# EAGLE design redox-light-right (EAGLE 9.1.3)
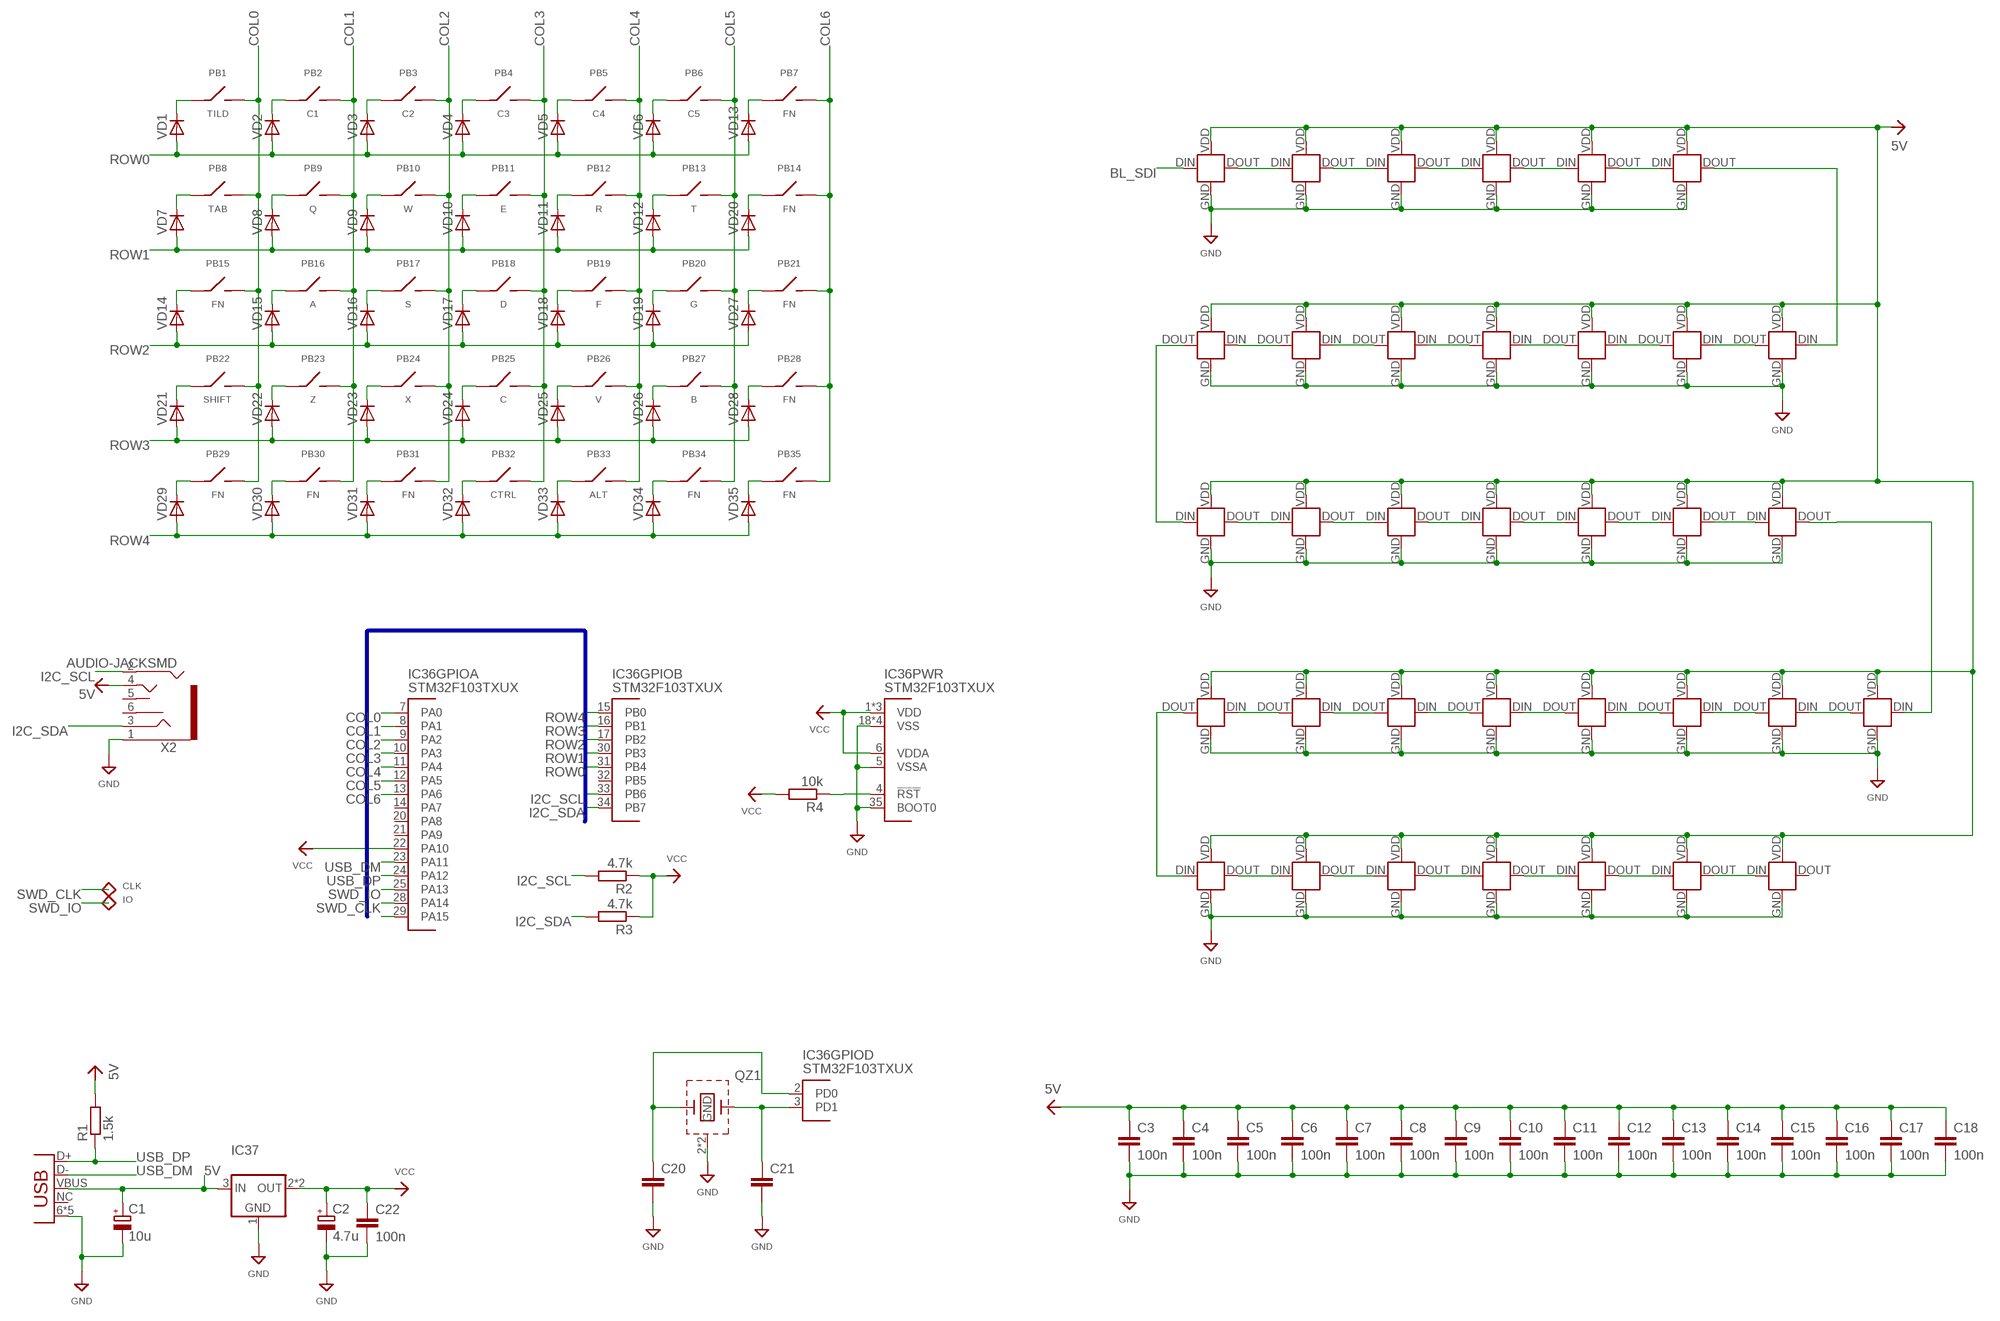
[diagram p0: schematic, sheet 1]

## Parts
C1  10u  CPOL-EUSMCA  [SMC_A]
C2  4.7u  CPOL-EUSMCA  [SMC_A]
C3  100n  CAP0402  [R0402]
C4  100n  CAP0402  [R0402]
C5  100n  CAP0402  [R0402]
C6  100n  CAP0402  [R0402]
C7  100n  CAP0402  [R0402]
C8  100n  CAP0402  [R0402]
C9  100n  CAP0402  [R0402]
C10  100n  CAP0402  [R0402]
C11  100n  CAP0402  [R0402]
C12  100n  CAP0402  [R0402]
C13  100n  CAP0402  [R0402]
C14  100n  CAP0402  [R0402]
C15  100n  CAP0402  [R0402]
C16  100n  CAP0402  [R0402]
C17  100n  CAP0402  [R0402]
C18  100n  CAP0402  [R0402]
C20  CAP0402  [R0402]
C21  CAP0402  [R0402]
C22  100n  CAP0402  [R0402]
IC1  SK68XX-MINI  [SK68XX-MINI]
IC2  SK68XX-MINI  [SK68XX-MINI]
IC3  SK68XX-MINI  [SK68XX-MINI]
IC4  SK68XX-MINI  [SK68XX-MINI]
IC5  SK68XX-MINI  [SK68XX-MINI]
IC6  SK68XX-MINI  [SK68XX-MINI]
IC7  SK68XX-MINI  [SK68XX-MINI]
IC8  SK68XX-MINI  [SK68XX-MINI]
IC9  SK68XX-MINI  [SK68XX-MINI]
IC10  SK68XX-MINI  [SK68XX-MINI]
IC11  SK68XX-MINI  [SK68XX-MINI]
IC12  SK68XX-MINI  [SK68XX-MINI]
IC13  SK68XX-MINI  [SK68XX-MINI]
IC14  SK68XX-MINI  [SK68XX-MINI]
IC15  SK68XX-MINI  [SK68XX-MINI]
IC16  SK68XX-MINI  [SK68XX-MINI]
IC17  SK68XX-MINI  [SK68XX-MINI]
IC18  SK68XX-MINI  [SK68XX-MINI]
IC19  SK68XX-MINI  [SK68XX-MINI]
IC20  SK68XX-MINI  [SK68XX-MINI]
IC21  SK68XX-MINI  [SK68XX-MINI]
IC22  SK68XX-MINI  [SK68XX-MINI]
IC23  SK68XX-MINI  [SK68XX-MINI]
IC24  SK68XX-MINI  [SK68XX-MINI]
IC25  SK68XX-MINI  [SK68XX-MINI]
IC26  SK68XX-MINI  [SK68XX-MINI]
IC27  SK68XX-MINI  [SK68XX-MINI]
IC28  SK68XX-MINI  [SK68XX-MINI]
IC29  SK68XX-MINI  [SK68XX-MINI]
IC30  SK68XX-MINI  [SK68XX-MINI]
IC31  SK68XX-MINI  [SK68XX-MINI]
IC32  SK68XX-MINI  [SK68XX-MINI]
IC33  SK68XX-MINI  [SK68XX-MINI]
IC34  SK68XX-MINI  [SK68XX-MINI]
IC35  SK68XX-MINI  [SK68XX-MINI]
IC36  STM32F103TXUX  [QFN-36]
IC37  LM1117  [SOT89]
PB1  TILD  CHERRY-MX-KAILH  [CHERRY-MX-KAILH]
PB2  C1  CHERRY-MX-KAILH  [CHERRY-MX-KAILH]
PB3  C2  CHERRY-MX-KAILH  [CHERRY-MX-KAILH]
PB4  C3  CHERRY-MX-KAILH  [CHERRY-MX-KAILH]
PB5  C4  CHERRY-MX-KAILH  [CHERRY-MX-KAILH]
PB6  C5  CHERRY-MX-KAILH  [CHERRY-MX-KAILH]
PB7  FN  CHERRY-MX-KAILH  [CHERRY-MX-KAILH]
PB8  TAB  CHERRY-MX-KAILH  [CHERRY-MX-KAILH]
PB9  Q  CHERRY-MX-KAILH  [CHERRY-MX-KAILH]
PB10  W  CHERRY-MX-KAILH  [CHERRY-MX-KAILH]
PB11  E  CHERRY-MX-KAILH  [CHERRY-MX-KAILH]
PB12  R  CHERRY-MX-KAILH  [CHERRY-MX-KAILH]
PB13  T  CHERRY-MX-KAILH  [CHERRY-MX-KAILH]
PB14  FN  CHERRY-MX-KAILH  [CHERRY-MX-KAILH]
PB15  FN  CHERRY-MX-KAILH  [CHERRY-MX-KAILH]
PB16  A  CHERRY-MX-KAILH  [CHERRY-MX-KAILH]
PB17  S  CHERRY-MX-KAILH  [CHERRY-MX-KAILH]
PB18  D  CHERRY-MX-KAILH  [CHERRY-MX-KAILH]
PB19  F  CHERRY-MX-KAILH  [CHERRY-MX-KAILH]
PB20  G  CHERRY-MX-KAILH  [CHERRY-MX-KAILH]
PB21  FN  CHERRY-MX-KAILH  [CHERRY-MX-KAILH]
PB22  SHIFT  CHERRY-MX-KAILH  [CHERRY-MX-KAILH]
PB23  Z  CHERRY-MX-KAILH  [CHERRY-MX-KAILH]
PB24  X  CHERRY-MX-KAILH  [CHERRY-MX-KAILH]
PB25  C  CHERRY-MX-KAILH  [CHERRY-MX-KAILH]
PB26  V  CHERRY-MX-KAILH  [CHERRY-MX-KAILH]
PB27  B  CHERRY-MX-KAILH  [CHERRY-MX-KAILH]
PB28  FN  CHERRY-MX-KAILH  [CHERRY-MX-KAILH]
PB29  FN  CHERRY-MX-KAILH  [CHERRY-MX-KAILH]
PB30  FN  CHERRY-MX-KAILH  [CHERRY-MX-KAILH]
PB31  FN  CHERRY-MX-KAILH  [CHERRY-MX-KAILH]
PB32  CTRL  CHERRY-MX-KAILH  [CHERRY-MX-KAILH]
PB33  ALT  CHERRY-MX-KAILH  [CHERRY-MX-KAILH]
PB34  FN  CHERRY-MX-KAILH  [CHERRY-MX-KAILH]
PB35  FN  CHERRY-MX-KAILH  [CHERRY-MX-KAILH]
QZ1  QUARTZ_GND3225  [3225]
R1  1.5k  RESR0402  [R0402]
R2  4.7k  RESR0402  [R0402]
R3  4.7k  RESR0402  [R0402]
R4  10k  RESR0402  [R0402]
TP1  CLK  TP10R  [TP10R]
TP2  IO  TP10R  [TP10R]
VD1  DIODE-SOD123  [SOD123]
VD2  DIODE-SOD123  [SOD123]
VD3  DIODE-SOD123  [SOD123]
VD4  DIODE-SOD123  [SOD123]
VD5  DIODE-SOD123  [SOD123]
VD6  DIODE-SOD123  [SOD123]
VD7  DIODE-SOD123  [SOD123]
VD8  DIODE-SOD123  [SOD123]
VD9  DIODE-SOD123  [SOD123]
VD10  DIODE-SOD123  [SOD123]
VD11  DIODE-SOD123  [SOD123]
VD12  DIODE-SOD123  [SOD123]
VD13  DIODE-SOD123  [SOD123]
VD14  DIODE-SOD123  [SOD123]
VD15  DIODE-SOD123  [SOD123]
VD16  DIODE-SOD123  [SOD123]
VD17  DIODE-SOD123  [SOD123]
VD18  DIODE-SOD123  [SOD123]
VD19  DIODE-SOD123  [SOD123]
VD20  DIODE-SOD123  [SOD123]
VD21  DIODE-SOD123  [SOD123]
VD22  DIODE-SOD123  [SOD123]
VD23  DIODE-SOD123  [SOD123]
VD24  DIODE-SOD123  [SOD123]
VD25  DIODE-SOD123  [SOD123]
VD26  DIODE-SOD123  [SOD123]
VD27  DIODE-SOD123  [SOD123]
VD28  DIODE-SOD123  [SOD123]
VD29  DIODE-SOD123  [SOD123]
VD30  DIODE-SOD123  [SOD123]
VD31  DIODE-SOD123  [SOD123]
VD32  DIODE-SOD123  [SOD123]
VD33  DIODE-SOD123  [SOD123]
VD34  DIODE-SOD123  [SOD123]
VD35  DIODE-SOD123  [SOD123]
X1  USBMICRO_B  [USB_MICROB]
X2  AUDIO-JACKSMD  [PJ-342]

## Nets
5V: C1.+ C3.1 C4.1 C5.1 C6.1 C7.1 C8.1 C9.1 C10.1 C11.1 C12.1 C13.1 C14.1 C15.1 C16.1 C17.1 C18.1 IC1.VDD(VCC) IC2.VDD(VCC) IC3.VDD(VCC) IC4.VDD(VCC) IC5.VDD(VCC) IC6.VDD(VCC) IC7.VDD(VCC) IC8.VDD(VCC) IC9.VDD(VCC) IC10.VDD(VCC) IC11.VDD(VCC) IC12.VDD(VCC) IC13.VDD(VCC) IC14.VDD(VCC) IC15.VDD(VCC) IC16.VDD(VCC) IC17.VDD(VCC) IC18.VDD(VCC) IC19.VDD(VCC) IC20.VDD(VCC) IC21.VDD(VCC) IC22.VDD(VCC) IC23.VDD(VCC) IC24.VDD(VCC) IC25.VDD(VCC) IC26.VDD(VCC) IC27.VDD(VCC) IC28.VDD(VCC) IC29.VDD(VCC) IC30.VDD(VCC) IC31.VDD(VCC) IC32.VDD(VCC) IC33.VDD(VCC) IC34.VDD(VCC) IC35.VDD(VCC) IC37.3(IN) R1.2 X1.VBUS X2.4
BL_SDI: IC1.DIN IC36.29(GPIOA:PA15)
COL0 [KEYS-MATRIX]: IC36.7(GPIOA:PA0) PB1.2 PB8.2 PB15.2 PB22.2 PB29.2
COL1 [KEYS-MATRIX]: IC36.8(GPIOA:PA1) PB2.2 PB9.2 PB16.2 PB23.2 PB30.2
COL2 [KEYS-MATRIX]: IC36.9(GPIOA:PA2) PB3.2 PB10.2 PB17.2 PB24.2 PB31.2
COL3 [KEYS-MATRIX]: IC36.10(GPIOA:PA3) PB4.2 PB11.2 PB18.2 PB25.2 PB32.2
COL4 [KEYS-MATRIX]: IC36.11(GPIOA:PA4) PB5.2 PB12.2 PB19.2 PB26.2 PB33.2
COL5 [KEYS-MATRIX]: IC36.12(GPIOA:PA5) PB6.2 PB13.2 PB20.2 PB27.2 PB34.2
COL6 [KEYS-MATRIX]: IC36.13(GPIOA:PA6) PB7.2 PB14.2 PB21.2 PB28.2 PB35.2
GND: C1.- C2.- C3.2 C4.2 C5.2 C6.2 C7.2 C8.2 C9.2 C10.2 C11.2 C12.2 C13.2 C14.2 C15.2 C16.2 C17.2 C18.2 C20.2 C21.2 C22.2 IC1.GND IC2.GND IC3.GND IC4.GND IC5.GND IC6.GND IC7.GND IC8.GND IC9.GND IC10.GND IC11.GND IC12.GND IC13.GND IC14.GND IC15.GND IC16.GND IC17.GND IC18.GND IC19.GND IC20.GND IC21.GND IC22.GND IC23.GND IC24.GND IC25.GND IC26.GND IC27.GND IC28.GND IC29.GND IC30.GND IC31.GND IC32.GND IC33.GND IC34.GND IC35.GND IC36.5(PWR:VSSA) IC36.18(PWR:VSS) IC36.26(PWR:VSS) IC36.35(PWR:BOOT0) IC36.36(PWR:VSS) IC36.PGND(PWR:VSS) IC37.1(GND) QZ1.2(GND) QZ1.4(GND) X1.6(GND) X1.7(GND) X1.8(GND) X1.9(GND) X1.GND X2.1
I2C_SCL: IC36.33(GPIOB:PB6) R2.2 X2.2
I2C_SDA: IC36.34(GPIOB:PB7) R3.2 X2.3
N$1: IC1.DOUT IC2.DIN
N$2: IC2.DOUT IC3.DIN
N$3: IC3.DOUT IC4.DIN
N$4: IC4.DOUT IC5.DIN
N$5: IC5.DOUT IC6.DIN
N$6: IC7.DOUT IC8.DIN
N$7: PB1.1 VD1.C
N$8: IC21.DOUT IC22.DIN
N$9: IC22.DOUT IC23.DIN
N$10: IC23.DOUT IC24.DIN
N$11: IC24.DOUT IC25.DIN
N$12: IC25.DOUT IC26.DIN
N$13: IC8.DOUT IC9.DIN
N$14: IC13.DOUT IC14.DIN
N$15: IC26.DOUT IC27.DIN
N$16: IC20.DOUT IC21.DIN
N$17: PB4.1 VD4.C
N$18: PB3.1 VD3.C
N$19: PB5.1 VD5.C
N$20: PB6.1 VD6.C
N$21: PB2.1 VD2.C
N$22: PB7.1 VD13.C
N$23: C20.1 IC36.2(GPIOD:PD0) QZ1.3
N$24: PB8.1 VD7.C
N$25: PB9.1 VD8.C
N$26: PB10.1 VD9.C
N$27: PB11.1 VD10.C
N$28: PB12.1 VD11.C
N$29: PB13.1 VD12.C
N$30: PB14.1 VD20.C
N$31: C21.1 IC36.3(GPIOD:PD1) QZ1.1
N$32: IC9.DOUT IC10.DIN
N$33: IC10.DOUT IC11.DIN
N$34: IC11.DOUT IC12.DIN
N$35: IC36.4(PWR:!RST) R4.1
N$36: IC12.DOUT IC13.DIN
N$37: IC6.DOUT IC7.DIN
N$38: IC14.DOUT IC15.DIN
N$39: IC15.DOUT IC16.DIN
N$40: IC16.DOUT IC17.DIN
N$41: IC17.DOUT IC18.DIN
N$42: IC18.DOUT IC19.DIN
N$44: IC19.DOUT IC20.DIN
N$46: PB15.1 VD14.C
N$47: PB16.1 VD15.C
N$48: PB17.1 VD16.C
N$49: PB18.1 VD17.C
N$50: PB19.1 VD18.C
N$51: PB20.1 VD19.C
N$52: IC27.DOUT IC28.DIN
N$53: IC29.DOUT IC30.DIN
N$54: PB22.1 VD21.C
N$55: PB23.1 VD22.C
N$56: PB29.1 VD29.C
N$57: PB30.1 VD30.C
N$58: PB24.1 VD23.C
N$59: PB25.1 VD24.C
N$60: PB26.1 VD25.C
N$61: PB27.1 VD26.C
N$62: PB21.1 VD27.C
N$63: PB28.1 VD28.C
N$64: PB31.1 VD31.C
N$65: PB32.1 VD32.C
N$66: PB33.1 VD33.C
N$67: PB34.1 VD34.C
N$68: PB35.1 VD35.C
N$69: IC30.DOUT IC31.DIN
N$70: IC31.DOUT IC32.DIN
N$71: IC32.DOUT IC33.DIN
N$72: IC33.DOUT IC34.DIN
N$74: IC34.DOUT IC35.DIN
N$75: IC28.DOUT IC29.DIN
ROW0 [KEYS-MATRIX]: IC36.31(GPIOB:PB4) VD1.A VD2.A VD3.A VD4.A VD5.A VD6.A VD13.A
ROW1 [KEYS-MATRIX]: IC36.30(GPIOB:PB3) VD7.A VD8.A VD9.A VD10.A VD11.A VD12.A VD20.A
ROW2 [KEYS-MATRIX]: IC36.17(GPIOB:PB2) VD14.A VD15.A VD16.A VD17.A VD18.A VD19.A VD27.A
ROW3 [KEYS-MATRIX]: IC36.16(GPIOB:PB1) VD21.A VD22.A VD23.A VD24.A VD25.A VD26.A VD28.A
ROW4 [KEYS-MATRIX]: IC36.15(GPIOB:PB0) VD29.A VD30.A VD31.A VD32.A VD33.A VD34.A VD35.A
SWD_CLK: IC36.28(GPIOA:PA14) TP1.TP(TEST)
SWD_IO: IC36.25(GPIOA:PA13) TP2.TP(TEST)
USB_DM: IC36.23(GPIOA:PA11) X1.D-
USB_DP: IC36.24(GPIOA:PA12) R1.1 X1.D+
VCC: C2.+ C22.1 IC36.1(PWR:VDD) IC36.6(PWR:VDDA) IC36.19(PWR:VDD) IC36.22(GPIOA:PA10) IC36.27(PWR:VDD) IC37.2(OUT) IC37.4(OUT) R2.1 R3.1 R4.2
Unconnected: IC35.DOUT IC36.14(GPIOA:PA7) IC36.20(GPIOA:PA8) IC36.21(GPIOA:PA9) IC36.32(GPIOB:PB5) X1.NC X2.5 X2.6

## Buses
BL_SDI,COL[0..7],FLASH_CS,I2C_SCL,I2C_SDA,ROW[0..4],SPI_MISO,SPI_MOSI,SPI_SCL,SR_CLK,SR_CLR,SR_D,SWD_CLK,SWD_IO,UART_RX,UART_TX,USB_DM,USB_DP

## Library data of the parts
C1 C2 = netcat:CPOL-EU
C3-C18 C20-C22 = netcat:CAP
IC1-IC6 IC14-IC35 = keyb:SK68XX
IC7-IC13 = keyb:SK68XX; SPICEPREFIX: E
IC36 = netcat:STM32F103
IC37 = netcat:LM1117
PB1-PB35 = keyb:CHERRY-MX
QZ1 = netcat:QUARTZ_GND
R1-R4 = netcat:RES
TP1 TP2 = netcat:TP
VD1-VD35 = netcat:DIODE
X1 = netcat:USB: USB Connectors USB-B-PTH is fully proven SKU : PRT-00139 USB-miniB is fully proven SKU : PRT-00587 USB-A-PCB is untested. USB-A-H is throughly reviewed, but untested. Spark Fun Electronics SKU : PRT-00437 USB-B-SMT is throughly reviewed, but untested. Needs silkscreen touching up. USB-A-S has not been used/tested USB-MB-H has not been used/tested
X2 = netcat:AUDIO-JACK

## Board
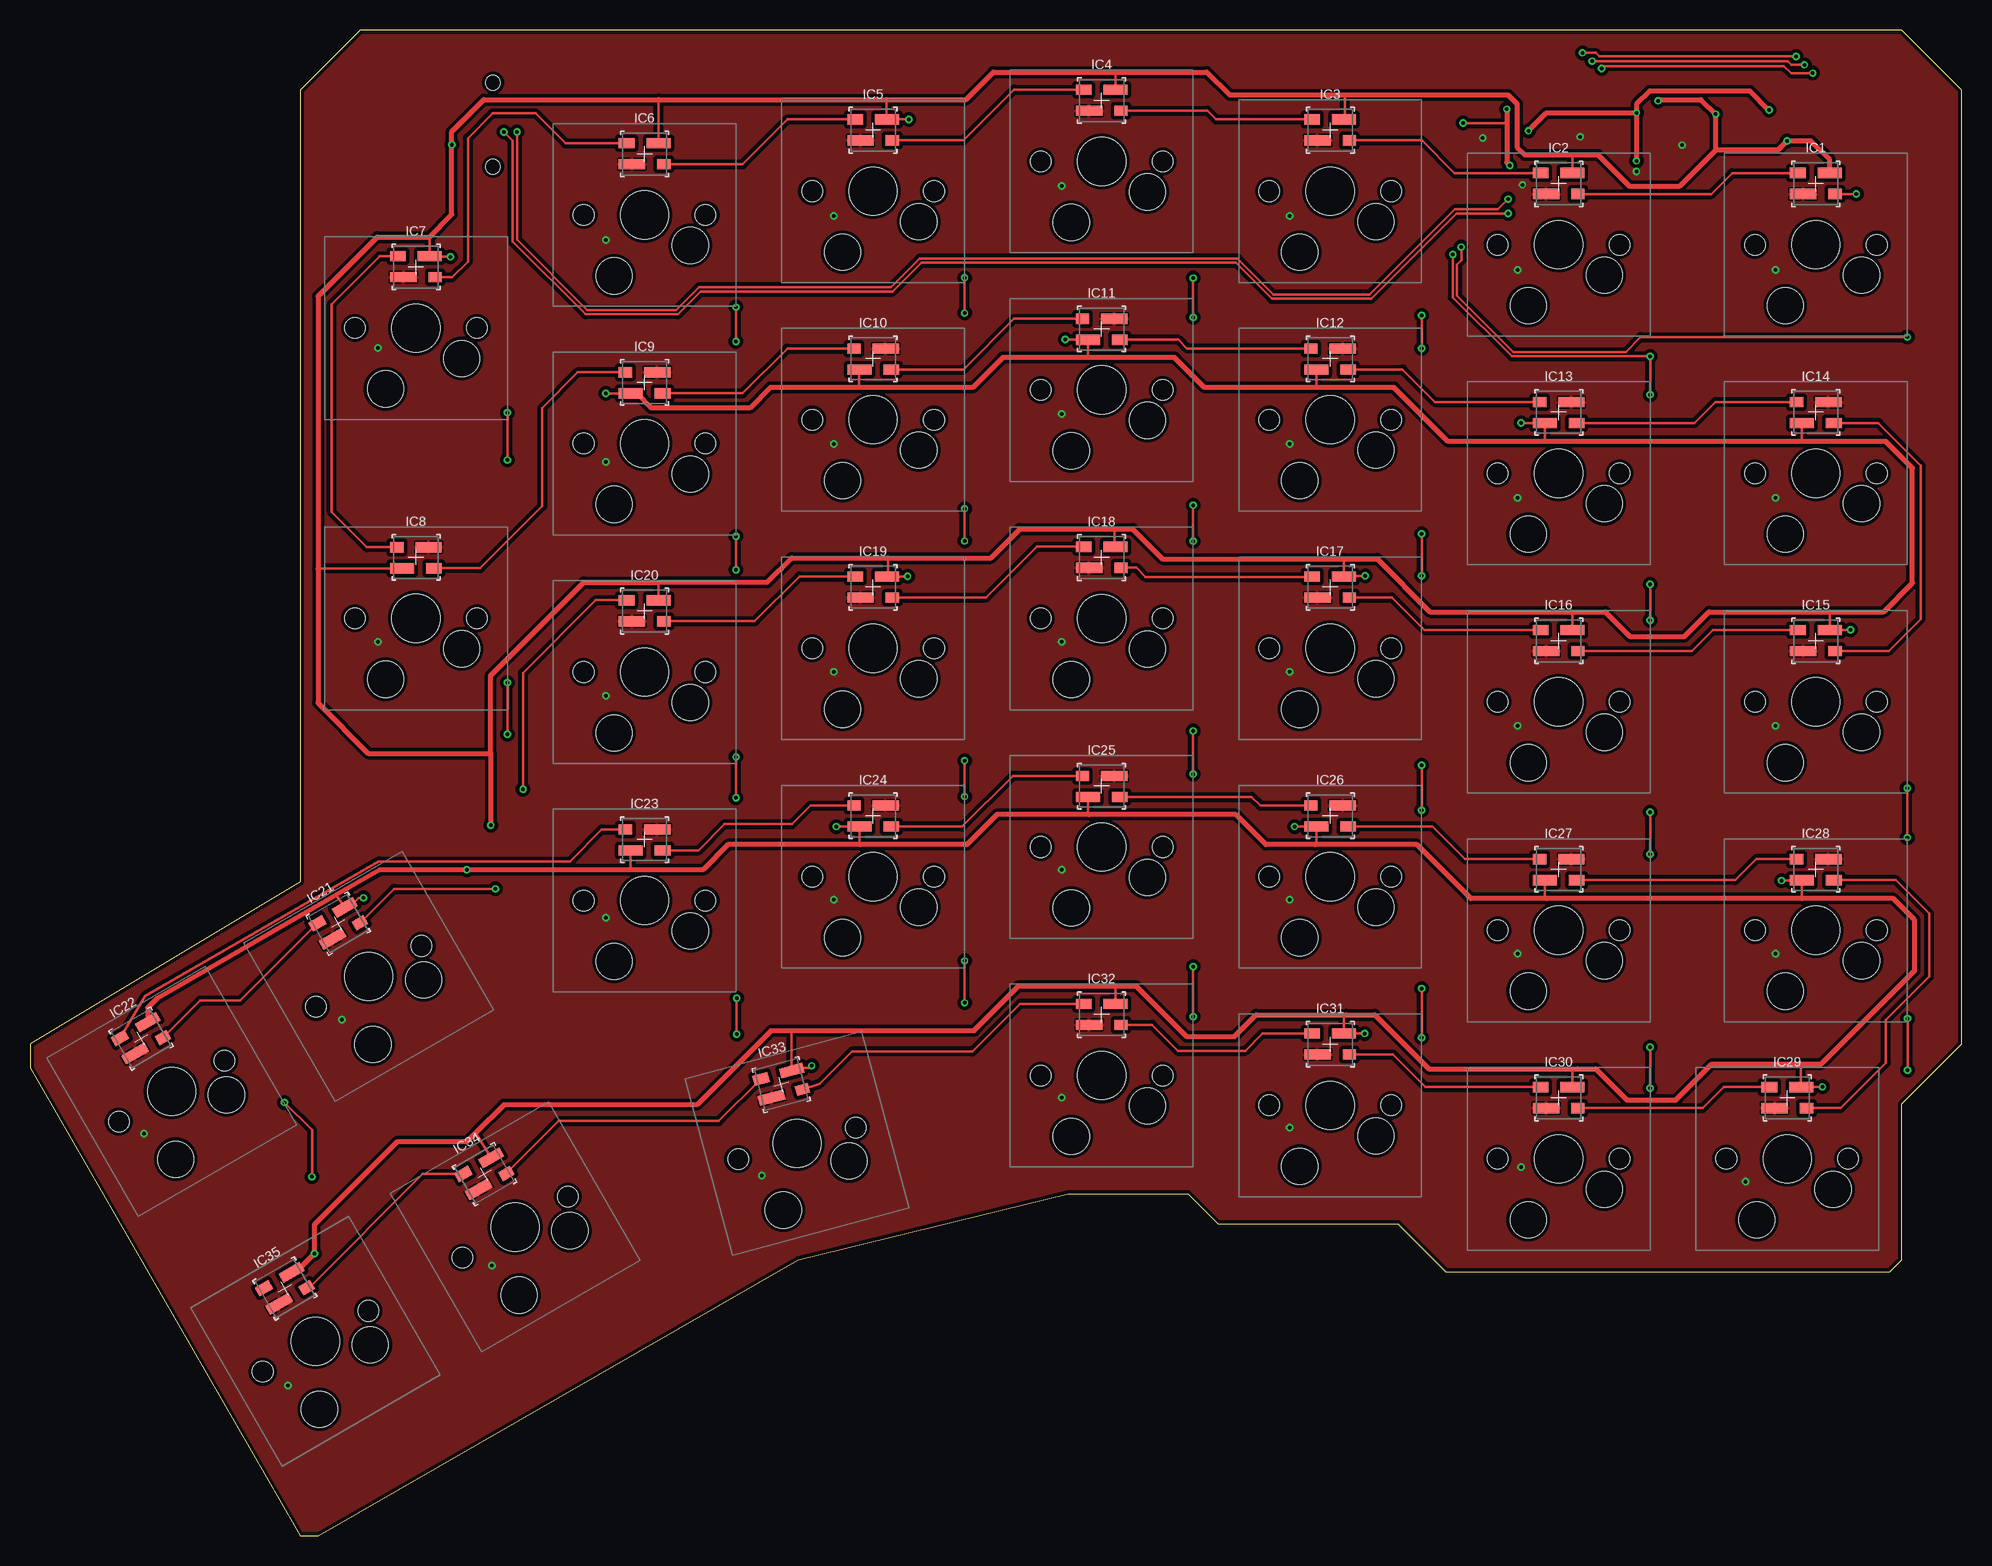
[diagram p1: board, top side]
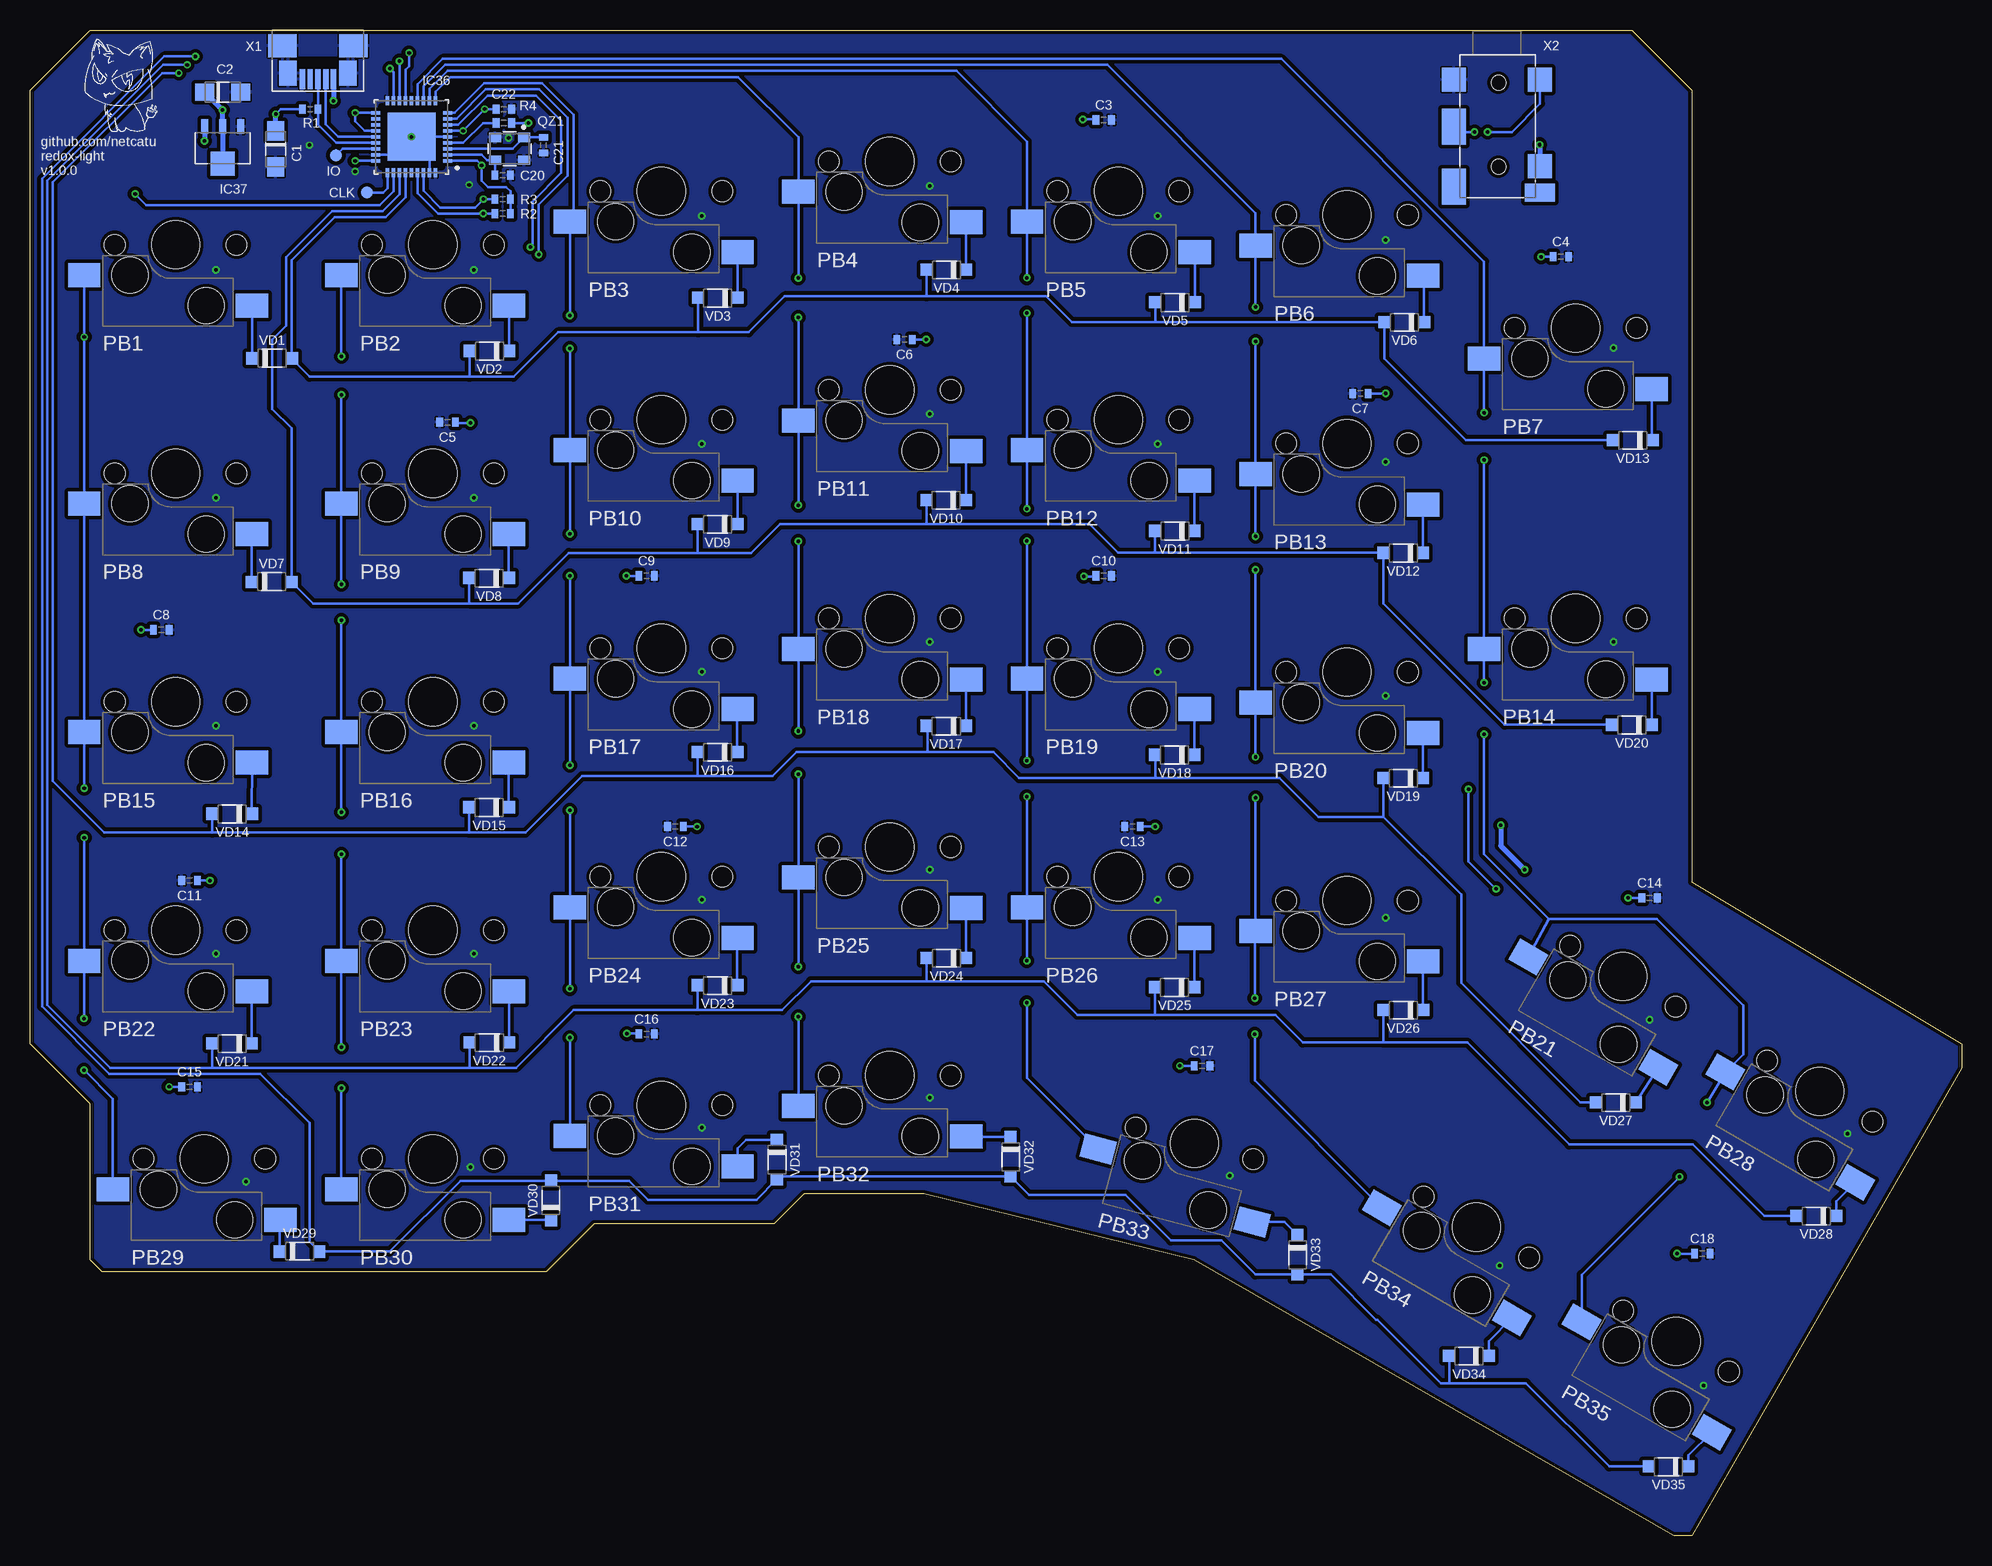
[diagram p2: board, bottom side, seen from below]

Size 161 x 125.5 mm. Coordinates in mm from the lower left corner, seen from the top.
Outline: 161,120.5 156,125.5 27.5,125.5 22.5,120.5 22.5,54.5 0,41 0,39 22.5,0 24,0 64,23 86.5,28.5 96.5,28.5 99,26 114,26 118,22 155,22 156,23 156,36 161,41 161,120.5
Copper layers (1+16): Top 0.035mm / dielectric 0.2mm / Bottom 0.035mm
Design rules "mini-spartan6-plus *": minimum track width 6mil, minimum drill 6mil, track to track 6mil, track to pad 6mil, pad to pad 6mil, via to via 6mil, smd to smd 0mil, copper to edge 6mil, drill to drill 6mil, minimum pad ring 10mil, minimum via ring 6mil, stop-mask expansion 2mil, vias tented up to drill 100mil, thermal gap 6mil
bRestrict: area 127.1,114.1 to 127.4,114.5; area 126.7,114.1 to 127.1,116.3; area 128,114.1 to 131.3,114.5; area 131.3,114.1 to 131.7,114.8; area 131.3,115.3 to 131.7,119.1; area 126.7,118.7 to 131.3,119.1; area 126.7,116.8 to 127.1,118.7

### Footprints (pad centres in the part's own frame; a part is rotated, then mirrored left to right if it is on the bottom)
SMC_A = smd 1.6 x 1.4: + -1.5,0; - 1.5,0
R0402 = smd 0.559 x 0.762: 1 -0.65,0; 2 0.65,0
SK68XX-MINI = smd 1.1 x 0.85: DIN 1.6,-0.85 | smd 1.3 x 0.85: DOUT -1.5,0.9 | smd 2.2 x 0.85: GND -1.05,-0.85 | smd 2 x 0.85: VDD 1.15,0.9
QFN-36 = smd 0.75 x 0.3: 1 -3,2; 2 -3,1.5; 3 -3,1; 4 -3,0.5; 5 -3,0; 6 -3,-0.5; 7 -3,-1; 8 -3,-1.5; 9 -3,-2; 19 3,-2; 20 3,-1.5; 21 3,-1; 22 3,-0.5; 23 3,0; 24 3,0.5; 25 3,1; 26 3,1.5; 27 3,2 | smd 0.3 x 0.75: 10 -2,-3; 11 -1.5,-3; 12 -1,-3; 13 -0.5,-3; 14 0,-3; 15 0.5,-3; 16 1,-3; 17 1.5,-3; 18 2,-3; 28 2,3; 29 1.5,3; 30 1,3; 31 0.5,3; 32 0,3; 33 -0.5,3; 34 -1,3; 35 -1.5,3; 36 -2,3 | smd 4 x 4: PGND 0,0
SOT89 = smd 0.58 x 1.2: 1 -1.5,-1.8; 2 0,-1.8; 3 1.5,-1.8 | smd 2 x 2: 4 0,1.3
CHERRY-MX-KAILH = smd 2.7 x 2 bottom: 1 -6.355,-5.08; 2 7.625,-2.54 | hole 4: 0,0 | hole 1.7: -5.08,0; 5.08,0 | hole 3: 3.81,-2.54; -2.54,-5.08
3225 = smd 1.016 x 0.762: 1 -1.28,-0.948; 2 1.121,-0.948; 3 1.121,0.948; 4 -1.28,0.948
TP10R = smd 1 x 1: TP 0,0
SOD123 = smd 1.016 x 1.016: A 1.646,-0.025; C -1.646,-0.025
USB_MICROB = smd 2.1 x 1.475: 6 2.3,-2.5; 8 2.3,2.5 | smd 1.9 x 2.375: 7 0,-2.95; 9 0,2.95 | smd 1.7 x 0.45: D+ 2.8,0; D- 2.8,0.65; GND 2.8,-1.3; NC 2.8,-0.65; VBUS 2.8,1.3
PJ-342 = smd 2 x 2: 1 -3.44,-3.73; 2 -3.44,3.47; 4 3.76,3.47 | smd 3 x 2: 3 0.46,-3.73; 6 5.46,-3.73 | smd 1.5 x 2.5: 5 5.96,3.47 | hole 1.2: 3.8,0; -3.2,0

### Placement (x,y rotation side)
C1  140.51,115.58 270 bottom
C2  144.95,120.33 0 bottom
C3  71.5,118 0 bottom
C4  33.4,106.6 0 bottom
C5  126.2,92.8 180 bottom
C6  88.1,99.7 180 bottom
C7  50.1,95.2 180 bottom
C8  150.05,75.5 0 bottom
C9  109.6,80 0 bottom
C10  71.5,80 0 bottom
C11  147.7,54.6 180 bottom
C12  107.2,59.1 180 bottom
C13  69.1,59.1 180 bottom
C14  26,53.15 0 bottom
C15  147.7,37.4 0 bottom
C16  109.6,41.8 0 bottom
C17  63.3,39.15 0 bottom
C18  21.6,23.5 0 bottom
C20  121.6,113.4 0 bottom
C21  118.2,115.9 270 bottom
C22  121.5,118.9 0 bottom
IC1  148.86,112.68 0 top
IC2  127.42,112.68 0 top
IC3  108.38,117.14 0 top
IC4  89.33,119.62 0 top
IC5  70.28,117.14 0 top
IC6  51.22,115.16 0 top
IC7  32.17,105.74 0 top
IC8  32.17,81.53 180 top
IC9  51.22,96.11 180 top
IC10  70.28,98.09 180 top
IC11  89.33,100.57 180 top
IC12  108.38,98.09 180 top
IC13  127.42,93.63 180 top
IC14  148.86,93.63 180 top
IC15  148.86,74.58 0 top
IC16  127.42,74.58 0 top
IC17  108.38,79.04 0 top
IC18  89.33,81.52 0 top
IC19  70.28,79.04 0 top
IC20  51.22,77.06 0 top
IC21  25.7,51.01 30 top
IC22  9.26,41.43 30 top
IC23  51.22,58.01 180 top
IC24  70.28,59.99 180 top
IC25  89.33,62.47 180 top
IC26  108.38,59.99 180 top
IC27  127.42,55.53 180 top
IC28  148.86,55.53 180 top
IC29  146.47,36.48 0 top
IC30  127.42,36.48 0 top
IC31  108.38,40.94 0 top
IC32  89.33,43.42 0 top
IC33  62.62,37.59 15 top
IC34  37.89,30.12 30 top
IC35  21.25,20.59 30 top
IC36  129.2,116.6 180 bottom
IC37  144.95,115.65 180 bottom
PB1  148.86,107.6 0 top
PB2  127.42,107.6 0 top
PB3  108.38,112.06 0 top
PB4  89.33,114.54 0 top
PB5  70.28,112.06 0 top
PB6  51.22,110.08 0 top
PB7  32.17,100.66 0 top
PB8  148.86,88.55 0 top
PB9  127.42,88.55 0 top
PB10  108.38,93.01 0 top
PB11  89.33,95.49 0 top
PB12  70.28,93.01 0 top
PB13  51.22,91.03 0 top
PB14  32.17,76.45 0 top
PB15  148.86,69.5 0 top
PB16  127.42,69.5 0 top
PB17  108.38,73.96 0 top
PB18  89.33,76.44 0 top
PB19  70.28,73.96 0 top
PB20  51.22,71.98 0 top
PB21  28.24,46.61 30 top
PB22  148.86,50.45 0 top
PB23  127.42,50.45 0 top
PB24  108.38,54.91 0 top
PB25  89.33,57.39 0 top
PB26  70.28,54.91 0 top
PB27  51.22,52.93 0 top
PB28  11.8,37.03 30 top
PB29  146.47,31.4 0 top
PB30  127.42,31.4 0 top
PB31  108.38,35.86 0 top
PB32  89.33,38.34 0 top
PB33  63.93,32.69 15 top
PB34  40.43,25.72 30 top
PB35  23.79,16.19 30 top
QZ1  121.1,115.6 180 bottom
R1  137.65,118.9 180 bottom
R2  121.6,110.2 180 bottom
R3  121.6,111.4 180 bottom
R4  121.5,117.75 0 bottom
TP1  132.9,111.95 0 bottom
TP2  135.5,115.05 0 bottom
U$1  [LOGO2]  153.4,120.9 0 bottom
VD1  140.82,98.14 0 bottom
VD2  122.7,98.73 180 bottom
VD3  103.67,103.15 180 bottom
VD4  84.62,105.5 180 bottom
VD5  65.56,102.78 180 bottom
VD6  46.44,101.13 180 bottom
VD7  140.85,79.52 0 bottom
VD8  122.74,79.8 180 bottom
VD9  103.69,84.28 180 bottom
VD10  84.64,86.28 180 bottom
VD11  65.57,83.73 180 bottom
VD12  46.53,81.9 180 bottom
VD13  27.4,91.3 180 bottom
VD14  144.15,60.14 180 bottom
VD15  122.73,60.68 180 bottom
VD16  103.69,65.28 180 bottom
VD17  84.63,67.47 180 bottom
VD18  65.59,65.07 180 bottom
VD19  46.53,63.12 180 bottom
VD20  27.49,67.56 180 bottom
VD21  144.16,41 180 bottom
VD22  122.71,41.08 180 bottom
VD23  103.69,45.84 180 bottom
VD24  84.62,48.13 180 bottom
VD25  65.59,45.69 180 bottom
VD26  46.52,43.79 180 bottom
VD27  28.8,36.09 180 bottom
VD28  12.1,26.63 180 bottom
VD29  138.53,23.7 0 bottom
VD30  117.58,27.93 90 bottom
VD31  98.73,31.33 270 bottom
VD32  79.24,31.58 270 bottom
VD33  55.33,23.41 270 bottom
VD34  41.05,14.95 180 bottom
VD35  24.42,5.74 180 bottom
X1  137,124.2 270 bottom
X2  38.6,117.9 270 bottom

### Tracks (layer width: path | path; a pad name or v marks a point on that pad's centre or on a via)
5V  (via drill 0.3)
  Top 0.203: IC33.VDD 63.5,38.8 | 63.5,38.8 63.5,42 63.6,42.1 | IC32.VDD 90.47,45.77 90.5,45.8 | IC31.VDD | IC31.VDD 109.53,43.23 109.7,43.4 | IC30.VDD 128.57,38.9 129,38.9 | 147.6,39.3 147.6,37.41 IC29.VDD 149.38,37.38 v149.4,37.4 | 147.7,53.1 147.71,53.11 IC28.VDD 147.68,54.6 v146,54.6 | IC27.VDD 126.28,53.1 126.4,53.1 | IC25.VDD 88.17,60.23 88.3,60.1 | IC23.VDD 50.08,55.5 50.1,55.5 | 25.53,53.4 IC21.VDD 26.61,52.36 27.4,53.15 v27.8,53.15 | IC20.VDD 52.4,77.96 52.4,79.45 | IC18.VDD 90.4,82.42 90.4,83.9 | IC16.VDD 128.57,77 128.5,77 | IC14.VDD 147.71,91.2 147.7,91.2 | IC12.VDD 107.22,95.7 107.4,95.7 | 88.3,98.2 88.17,98.2 IC11.VDD 86.33,99.67 v86.3,99.7 | IC10.VDD 69.1,97.19 69.1,95.7 | IC34.VDD 37.15,33.55 | IC6.VDD 52.38,119.67 52.4,119.7 | IC8.VDD 30.99,80.6 24,80.6 | 33.3,108.25 33.3,106.66 IC7.VDD 33.36,106.6 v35.05,106.6 | IC3.VDD 109.6,118.12 109.6,120.1 | v65.15,39.15 65,39 63.7,39 63.5,38.8 | v111.25,41.85 IC31.VDD | v105.4,59.1 v105.41,59.09 IC26.VDD 107.22,57.7 107.2,57.7 107.1,57.6 | v67.2,59.1 v67.21,59.09 IC24.VDD 69.12,57.6 69.2,57.6 | v73.15,79.95 v73.14,79.94 IC19.VDD 71.5,79.94 71.5,81.5 | v111.3,80 109.58,80 IC17.VDD 109.5,79.94 109.5,81.4 | v151.75,75.5 151.73,75.48 IC15.VDD 150,77 | v124.3,92.75 124.32,92.73 IC13.VDD 126.28,91.2 126.2,91.2 | IC9.VDD v48,95.2 | v73.25,118.05 v73.24,118.04 IC5.VDD 71.4,118.04 71.4,119.7 | IC2.VDD 128.57,115.1 128.6,115.1 | IC4.VDD 90.47,122 90.4,122
  Top 0.406: IC35.VDD 22.15,21.95 v23.7,23.5 23.7,25.9 30.6,32.8 36.4,32.8 37.15,33.55 39.5,35.9 55.6,35.9 61.8,42.1 63.6,42.1 78.7,42.1 82.4,45.8 90.5,45.8 92.2,45.8 96.4,41.6 100.4,41.6 102.2,43.4 109.7,43.4 112.1,43.4 116.6,38.9 129,38.9 130.5,38.9 133.1,36.3 137.2,36.3 140.2,39.3 147.6,39.3 149.3,39.3 157.1,47.1 157.1,51.3 155.3,53.1 147.7,53.1 126.4,53.1 120.1,53.1 115.6,57.6 107.1,57.6 103,57.6 100.5,60.1 88.3,60.1 80.6,60.1 78.1,57.6 69.2,57.6 58.2,57.6 56.1,55.5 50.1,55.5 v36.4,55.5 29.16,55.5 25.53,53.4 10.59,44.79 9.8,44 IC22.VDD | IC9.VDD 50.59,95.21 51.8,94 60,94 61.7,95.7 69.1,95.7 78.6,95.7 81.1,98.2 88.3,98.2 95.4,98.2 97.9,95.7 107.4,95.7 113.7,95.7 118.2,91.2 126.2,91.2 147.7,91.2 154.7,91.2 156.9,89 156.9,79.4 154.5,77 150,77 139.95,77 137.9,74.95 133.35,74.95 131.3,77 128.5,77 116.7,77 112.3,81.4 109.5,81.4 94.4,81.4 91.9,83.9 90.4,83.9 82.5,83.9 80.1,81.5 71.5,81.5 63.5,81.5 61.45,79.45 52.4,79.45 46.15,79.45 38.4,71.7 38.4,65.2 | 38.4,65.2 v38.4,59.2 | 140.5,118.48 v140.51,118.48 | IC1.VDD 150.01,114.69 148.45,116.25 v146.45,116.25 145.7,115.5 140.5,115.5 | 140.5,115.5 137.5,112.5 133.3,112.5 130.7,115.1 128.6,115.1 128.4,115.1 124.6,115.1 123.95,115.75 123.95,119.35 123.2,120.1 109.6,120.1 100,120.1 98.1,122 90.4,122 80.3,122 78,119.7 71.4,119.7 52.4,119.7 37.82,119.7 35.16,117.04 v35.16,115.94 35.16,110.11 33.3,108.25 28.95,108.25 24,103.3 24,80.6 24,69.4 28.2,65.2 38.4,65.2 | 140.5,115.5 140.5,118.48 | 140.5,118.48 139.28,119.7 135.8,119.7 v135.7,119.6
  Bottom 0.203: R1.2 140.1,118.9 v140.51,118.48 | C17.1 v65.15,39.15 | C18.1 v23.7,23.5 | v111.25,41.85 110.3,41.85 C16.1 | v149.4,37.4 C15.1 | C11.1 v146,54.6 | v105.4,59.1 C12.1 | v67.2,59.1 C13.1 | C14.1 v27.8,53.15 | v73.15,79.95 72.2,79.95 C10.1 | C9.1 v111.3,80 | v151.75,75.5 C8.1 | v124.3,92.75 125.5,92.75 C5.1 | v86.3,99.7 C6.1 | v48,95.2 C7.1 | C4.1 v35.05,106.6 | v73.25,118.05 72.2,118.05 C3.1
  Bottom 0.406: v38.4,59.2 38.4,57.5 v36.4,55.5 | v35.16,115.94 35.16,114.17 X2.4 | X1.VBUS v135.7,119.6 | C1.+ v140.51,118.48 | IC37.3 v146.45,116.25
BL_SDI  (via drill 0.3)
  Top 0.203: IC1.DIN v152.23,111.83
  Bottom 0.203: IC36.29 130.7,112.05 131.85,110.9 151.3,110.9 v152.23,111.83
COL0  (via drill 0.3)
  Top 0.203: v156.5,38.8 v156.5,43.1 | v156.48,58.18 v156.48,62.28 | v119.3,107.4 119.3,106.3 118.96,105.96 118.96,103.35 123.65,98.66 133,98.66 134.24,99.9 v156.48,99.9 | v156.48,99.9 156.5,99.9 v156.48,99.9
  Bottom 0.203: PB29.2 154.1,36.4 v156.5,38.8 | v156.5,43.1 156.5,47.89 PB22.2 v156.48,58.18 | v156.48,62.28 PB15.2 PB8.2 v156.48,99.9 PB1.2 | v119.3,107.4 119.11,107.59 119.11,111.2 116.71,113.59 116.71,117.95 118.8,120.04 122.85,120.04 125.29,117.6 IC36.7
COL1  (via drill 0.3)
  Top 0.203: v135.05,37.3 v135.05,40.7 | v135.05,56.8 v135.05,60.3 | v135.05,76.3 v135.05,79.3 | v135.05,95.1 v135.05,98.3 123.5,98.3 118.6,103.2 v118.6,106.8
  Bottom 0.203: PB30.2 v135.05,37.3 | v135.05,40.7 PB23.2 v135.05,56.8 | v135.05,60.3 PB16.2 v135.05,76.3 | v135.05,79.3 PB9.2 v135.05,95.1 | v135.05,98.3 PB2.2 | v118.6,106.8 118.6,110.95 116.21,113.34 116.21,118.2 118.55,120.54 123,120.54 125.45,118.1 IC36.8
COL2  (via drill 0.3)
  Top 0.203: v116,41.5 v116,45.6 | v116,60.45 v116,64.2 | v116,80 v116,83.5 | v116,98.95 v116,101.7
  Bottom 0.203: PB31.2 v116,41.5 | v116,45.6 PB24.2 v116,60.45 | v116,64.2 PB17.2 v116,80 | v116,83.5 PB10.2 v116,98.95 | v116,101.7 PB3.2 115.7,109.82 115.7,118.45 118.3,121.05 123.15,121.05 125.6,118.6 IC36.9
COL3  (via drill 0.3)
  Top 0.203: v96.95,43.24 v96.95,47.42 | v96.95,63.47 v96.95,67.06 | v96.95,82.89 v96.95,85.89 | v96.95,101.54 v96.95,104.82
  Bottom 0.203: PB32.2 v96.95,43.24 | v96.95,47.42 PB25.2 v96.95,63.47 | v96.95,63.47 | v96.95,67.06 PB18.2 v96.95,82.89 | v96.95,85.89 PB11.2 v96.95,101.54 | v96.95,104.82 PB4.2 96.95,116.55 101.98,121.58 125.96,121.58 127.2,120.34 IC36.10
COL4  (via drill 0.3)
  Top 0.203: v77.9,44.4 v77.9,47.9 | v77.9,61.6 v77.9,64.6 | v77.9,82.9 v77.9,85.6 | v77.9,101.9 v77.9,104.85
  Bottom 0.203: PB33.2 77.9,38.15 v77.9,44.4 | v77.9,47.9 PB26.2 v77.9,61.6 | v77.9,64.6 PB19.2 v77.9,82.9 | v77.9,85.6 PB12.2 v77.9,101.9 | v77.9,104.85 PB5.2 77.9,116.2 83.79,122.09 126.2,122.09 127.7,120.59 IC36.11
COL5  (via drill 0.3)
  Top 0.203: v58.85,61.5 v58.85,64.9 | v58.85,80.5 v58.85,83.3 | v58.85,99.55 v58.85,102.4 | v58.9,41.8 v58.9,44.8
  Bottom 0.203: v58.85,61.5 PB27.2 58.9,50.34 v58.9,44.8 | v58.85,64.9 PB20.2 v58.85,80.5 | v58.85,83.3 PB13.2 v58.85,99.55 | v58.85,102.4 PB6.2 58.85,110.25 71.19,122.59 126.4,122.59 128.2,120.8 IC36.12 | PB34.2 58.9,37.93 v58.9,41.8
COL6  (via drill 0.3)
  Top 0.203: v23.5,29.9 23.5,33.8 v21.2,36.1 | v39.8,66.8 v39.8,71.1 | v39.8,89.65 v39.8,93.6
  Bottom 0.203: PB35.2 31.67,21.73 v23.5,29.9 | v39.8,71.1 PB14.2 v39.8,89.65 | v39.8,93.6 PB7.2 39.8,106.2 56.7,123.1 126.6,123.1 128.7,121 IC36.13 | v21.2,36.1 19.71,38.62 PB28.2 18.2,40.12 18.2,44.2 25.4,51.4 34.4,51.4 | 34.4,51.4 39.8,56.8 v39.8,66.8 | 34.4,51.4 PB21.2
GND  (via drill 0.3)
  Bottom 0.203: 129.15,117.69 129.15,116.6 | 129.15,116.6 IC36.5 | 129.15,116.55 129.15,115.46 129.51,115.1 IC36.26 | IC36.35 127.7,115.1 129.15,116.55 | 129.15,116.55 129.15,116.6
  other vias: 129.2,116.6 121.1,116.5 137.7,115.9 133.9,113.7 124.4,112.6 48,108 29,99 67,110 86,112.5 48,89.5 67,91 86,93.5 105,91 105,110 124,105.5 145.5,105.5 124,86.5 145.5,86.5 29,74.5 48,70 67,72 86,74.5 105,72 124,67.5 145.5,67.5 145.5,48.5 124,48.5 105,53 86,55.5 67,53 48,51.5 26,43 9.5,33.5 21.5,12.5 38.5,22.5 61,30 86,36.5 105,34 124.3,30.7 143,29.5
  pour Bottom (isolate 0.305): 161,41 156,36 156,23 155,22 118,22 114,26 99,26 96.5,28.5 86.5,28.5 64,23 24,0 22,0 0,39 0,41 22.5,54.3 22.5,120.5 27.5,125.5 156,125.5 161,120.5
  pour Top (isolate 0.305): 161,41 156,36 156,23 155,22 118,22 114,26 99,26 96.5,28.5 86.5,28.5 64,23 24,0 22,0 0,39 0,41 22.5,54.3 22.5,120.5 27.5,125.5 156,125.5 161,120.5
I2C_SCL  (via drill 0.3)
  Top 0.203: v123.2,110.2 118.9,110.2 111.8,103.1 103.5,103.1 100.5,106.1 74.3,106.1 71.9,103.7 55.9,103.7 54,101.8 46.3,101.8 40.24,107.86 40.24,116.26 v39.5,117
  Bottom 0.203: R2.2 v123.2,110.2 127,110.2 128.7,111.9 IC36.33 | v39.5,117 37.5,117 35.13,119.37 X2.2
I2C_SDA  (via drill 0.3)
  Top 0.203: v123.2,111.4 122.36,110.56 118.75,110.56 111.65,103.46 103.65,103.46 100.65,106.46 74.15,106.46 71.75,104.06 55.75,104.06 53.85,102.16 46.45,102.16 40.6,108 v40.6,117
  Bottom 0.203: R3.2 v123.2,111.4 123.89,110.71 126.8,110.71 128.2,112.1 IC36.34 | X2.3 41.89,117 v40.6,117
N$1
  Top 0.203: IC2.DIN 140.13,111.83 141.88,113.58 IC1.DOUT
N$2
  Top 0.203: IC3.DIN 116.01,116.29 118.72,113.58 IC2.DOUT
N$3
  Top 0.203: IC4.DIN 98.13,118.77 98.86,118.04 IC3.DOUT
N$4
  Top 0.203: IC5.DIN 77.79,116.29 82.02,120.52 IC4.DOUT
N$5
  Top 0.203: IC6.DIN 59.41,114.31 63.14,118.04 IC5.DOUT
N$6
  Top 0.203: IC7.DOUT 29.14,106.64 25.15,102.65 25.15,85.31 28.08,82.38 IC8.DIN
N$7
  Bottom 0.203: PB1.1 142.53,102.52 142.47,102.45 VD1.C
N$8
  Top 0.203: IC22.DIN 14.18,44.6 17.51,44.6 IC21.DOUT
N$9
  Top 0.203: IC23.DIN 47.66,58.86 45,56.2 29.07,56.2 9.6,44.98 IC22.DOUT
N$10
  Top 0.203: IC23.DOUT 55.71,57.11 57.9,59.3 63.5,59.3 65.04,60.84 IC24.DIN
N$11
  Top 0.203: IC25.DIN 81.92,63.32 77.69,59.09 IC24.DOUT
N$12
  Top 0.203: IC25.DOUT 101.83,61.57 102.56,60.84 IC26.DIN
N$13
  Top 0.203: IC9.DIN 45.66,96.96 42.7,94 42.7,85.8 37.53,80.63 IC8.DOUT
N$14
  Top 0.203: IC14.DIN 140.48,94.48 138.73,92.73 IC13.DOUT
N$15
  Top 0.203: IC27.DIN 119.62,56.38 116.91,59.09 IC26.DOUT
N$16  (via drill 0.3)
  Top 0.203: IC21.DIN 30.34,53.9 v38.8,53.9 | v41.1,62.2 41.1,71.9 47.16,77.96 IC20.DOUT
  Bottom 0.203: v38.8,53.9 41.1,56.2 v41.1,62.2
N$17
  Bottom 0.203: VD4.C PB4.1
N$18
  Bottom 0.203: VD3.C PB3.1
N$19
  Bottom 0.203: VD5.C PB5.1
N$20
  Bottom 0.203: VD6.C 44.8,105 PB6.1
N$21
  Bottom 0.203: VD2.C 121.07,98.76 PB2.1
N$22
  Bottom 0.203: VD13.C 25.82,91.33 PB7.1
N$23
  Bottom 0.203: C20.1 122.22,113.43 QZ1.3 122.9,114.65 123.35,115.1 IC36.2
N$24
  Bottom 0.203: VD7.C 142.5,79.51 PB8.1
N$25
  Bottom 0.203: VD8.C 121.09,83.47 PB9.1
N$26
  Bottom 0.203: VD9.C 102.02,84.3 PB10.1
N$27
  Bottom 0.203: VD10.C 82.99,90.41 PB11.1
N$28
  Bottom 0.203: VD11.C PB12.1
N$29
  Bottom 0.203: VD12.C 44.88,85.95 PB13.1
N$30
  Bottom 0.203: VD20.C 25.82,67.61 PB14.1
N$31
  Bottom 0.203: C21.1 QZ1.1 120.77,115.6 IC36.3
N$32
  Top 0.203: IC9.DOUT 59.41,95.21 63.14,98.94 IC10.DIN
N$33
  Top 0.203: IC10.DOUT 77.79,97.19 82.02,101.42 IC11.DIN
N$34
  Top 0.203: IC12.DIN 96.46,98.94 95.73,99.67 IC11.DOUT
N$35
  Bottom 0.203: R4.1 123.25,117.75 124.9,116.1 IC36.4
N$36
  Top 0.203: IC12.DOUT 114.41,97.19 117.12,94.48 IC13.DIN
N$37
  Top 0.203: IC7.DIN 35.19,104.89 36.5,106.2 36.5,116.5 38.56,118.56 42.12,118.56 44.62,116.06 IC6.DOUT
N$38
  Top 0.203: IC15.DIN 154.93,73.73 157.6,76.4 157.6,89.2 154.07,92.73 IC14.DOUT
N$39
  Top 0.203: IC16.DIN 138.53,73.73 140.28,75.48 IC15.DOUT
N$40
  Top 0.203: IC17.DIN 113.51,78.19 116.22,75.48 IC16.DOUT
N$41
  Top 0.203: IC17.DOUT 106.83,79.9 93,79.9 92.22,80.67 IC18.DIN
N$42
  Top 0.203: IC19.DIN 79.69,78.19 83.92,82.42 IC18.DOUT
N$44
  Top 0.203: IC20.DIN 60.41,76.21 64.14,79.94 IC19.DOUT
N$46
  Bottom 0.203: VD14.C PB15.1
N$47
  Bottom 0.203: VD15.C 121.09,64.4 PB16.1
N$48
  Bottom 0.203: VD16.C 102.04,68.88 PB17.1
N$49
  Bottom 0.203: VD17.C PB18.1
N$50
  Bottom 0.203: PB19.1 63.92,65.11 VD18.C
N$51
  Bottom 0.203: VD19.C 44.89,66.88 PB20.1
N$52
  Top 0.203: IC28.DIN 143.88,56.38 142.13,54.63 IC27.DOUT
N$53
  Top 0.203: IC30.DIN 139.43,35.63 141.18,37.38 IC29.DOUT
N$54
  Bottom 0.203: PB22.1 142.49,45.35 142.51,45.32 VD21.C
N$55
  Bottom 0.203: VD22.C PB23.1
N$56
  Bottom 0.203: VD29.C 140.18,26.32 PB29.1
N$57
  Bottom 0.203: VD30.C 117.56,26.32 PB30.1
N$58
  Bottom 0.203: VD23.C 102.05,49.83 PB24.1
N$59
  Bottom 0.203: VD24.C 82.97,51.7 82.9,51.7 82.9,52.31 PB25.1
N$60
  Bottom 0.203: VD25.C 63.95,49.83 PB26.1
N$61
  Bottom 0.203: VD26.C PB27.1
N$62
  Bottom 0.203: VD27.C PB21.1
N$63
  Bottom 0.203: PB28.1 10.45,27.84 VD28.C
N$64
  Bottom 0.203: VD31.C 101.32,32.98 102.02,32.28 PB31.1
N$65
  Bottom 0.203: VD32.C 82.93,33.23 PB32.1
N$66
  Bottom 0.203: VD33.C 56.43,26.13 PB33.1
N$67
  Bottom 0.203: PB34.1 39.41,16.2 VD34.C
N$68
  Bottom 0.203: PB35.1 22.78,6.67 VD35.C
N$69
  Top 0.203: IC31.DIN 113.61,40.09 116.32,37.38 IC30.DOUT
N$70
  Top 0.203: IC32.DIN 93.53,42.57 95.7,40.4 101.3,40.4 102.74,41.84 IC31.DOUT
N$71
  Top 0.203: IC32.DOUT 82.52,44.32 78.55,40.35 68.5,40.35 65.8,37.65 IC33.DIN
N$72
  Top 0.203: IC34.DIN 44.07,34.55 57.41,34.55 IC33.DOUT
N$74
  Top 0.203: IC35.DIN 23.25,20.66 32.75,30.14 IC34.DOUT
N$75
  Top 0.203: IC29.DIN 150.93,35.63 154.7,39.4 154.7,43 158.3,46.6 158.3,51.85 155.52,54.63 IC28.DOUT
ROW0
  Bottom 0.203: VD13.A 41.33,91.33 48.09,98.09 VD6.A 67.3,101.16 | 67.3,101.16 74.16,101.16 76.3,103.3 86.3,103.3 | 86.3,103.3 98.1,103.3 101.1,100.3 105.3,100.3 | 105.3,100.3 117,100.3 120.7,96.6 124.4,96.6 | VD2.A 124.35,96.6 124.4,96.6 | VD3.A 105.31,100.3 105.3,100.3 | VD4.A 86.26,103.3 86.3,103.3 | VD5.A 67.2,101.16 67.3,101.16 | 124.4,96.6 137.71,96.6 139.2,98.09 VD1.A 139.18,106.33 135.6,109.9 131.35,109.9 129.7,111.55 IC36.31
ROW1
  Bottom 0.203: 124.38,77.7 120.3,77.7 116.1,81.9 105.34,81.9 | 86.28,84.3 72.7,84.3 70.32,81.92 67.3,81.92 67.22,81.92 | 67.22,81.92 48.2,81.92 | 48.2,81.92 VD12.A | VD20.A 38.09,67.59 48.2,77.7 48.2,81.92 | VD11.A 67.22,81.92 | VD10.A 86.28,84.3 | 86.28,84.3 86.3,84.3 98.5,84.3 100.9,81.9 105.3,81.9 105.34,81.9 | VD9.A 105.34,81.9 | VD8.A 124.38,77.7 | 124.38,77.7 137.41,77.7 VD7.A 139.2,92.3 140.8,93.9 140.8,99.7 139.63,100.87 139.63,106.57 135.8,110.41 131.6,110.41 130.2,111.8 IC36.30
ROW2  (via drill 0.3)
  Top 0.203: v148.6,121.9 146.8,121.9 146.21,122.49 131.19,122.49 v131,122.3
  Bottom 0.203: 124.4,58.6 119.7,58.6 115,63.3 105.3,63.3 | 105.3,63.3 99.1,63.3 97.1,65.3 86.2,65.3 | 86.2,65.3 80.7,65.3 78.54,63.14 67.2,63.14 | 67.2,63.14 56.84,63.14 53.6,59.9 48.2,59.9 48.18,59.9 | VD19.A 48.18,59.9 | VD18.A 67.2,65.09 67.2,63.14 | VD17.A 86.2,67.5 86.2,65.3 | VD16.A 105.34,63.3 105.3,63.3 | VD15.A 124.38,58.6 124.4,58.6 | VD27.A 31.75,36.12 41.7,46.06 41.7,53.42 48.18,59.9 | 124.4,58.6 145.8,58.6 | 145.8,58.6 154.8,58.6 159.09,62.89 159.09,112.81 149.99,121.9 v148.6,121.9 | 145.8,58.6 145.79,58.61 VD14.A | IC36.17 130.7,122 v131,122.3
ROW3  (via drill 0.3)
  Top 0.203: v147.9,122.6 146.8,122.6 146.51,122.89 v130.21,122.89 v130.2,122.9
  Bottom 0.203: 48.2,41.1 54.9,41.1 57.2,43.4 67.2,43.4 | 67.2,43.4 73.7,43.4 76.5,46.2 86.3,46.2 | 86.3,46.2 95.9,46.2 98.3,43.8 105.4,43.8 | 105.4,43.8 115.7,43.8 120.5,39 124.4,39 | VD22.A 124.36,39.05 124.4,39 | VD23.A 105.34,43.8 105.4,43.8 | VD24.A 86.26,46.2 86.3,46.2 | VD25.A 67.24,43.4 67.2,43.4 | VD26.A 48.17,41.1 48.2,41.1 | 48.2,41.1 41.2,41.1 32.7,32.6 22.4,32.6 16.46,26.66 VD28.A | IC36.16 v130.2,122.9 | v147.9,122.6 149.9,122.6 159.54,112.95 159.54,44.25 154.3,39 145.8,39 | 124.4,39 145.8,39 | VD21.A 145.81,39.01 145.8,39
ROW4  (via drill 0.3)
  Top 0.203: v147.2,123.3 130.8,123.3 130.5,123.6 v129.4,123.6
  Bottom 0.203: VD35.A 29.36,5.76 36.3,12.7 42.7,12.7 | 42.7,12.7 43.4,12.7 48.7,18 48.8,18 52.56,21.76 VD33.A 58.86,21.76 61.7,24.6 65.9,24.6 69.7,28.4 77.73,28.4 VD32.A 98.51,29.93 VD31.A 100.45,28 109.5,28 111.08,29.58 VD30.A 125.12,29.58 131.03,23.67 VD29.A 137.7,24.49 137.7,34.4 141.8,38.5 154.4,38.5 160,44.1 160,113.1 149.8,123.3 v147.2,123.3 | VD34.A 42.7,12.7 | IC36.15 129.7,122.2 129.4,122.5 v129.4,123.6
SWD_CLK
  Bottom 0.203: IC36.28 131.2,112.3 131.55,111.95 TP1.TP
SWD_IO
  Bottom 0.203: IC36.25 134.95,115.6 TP2.TP
USB_DM
  Bottom 0.203: X1.D- 136.35,117.65 135.3,116.6 IC36.23
USB_DP
  Bottom 0.203: IC36.24 135.5,116.1 137,117.6 R1.1 X1.D+
VCC  (via drill 0.3)
  Top 0.203: v119.45,117.75 123.1,117.75 123.1,117.8
  Top 0.406: v144.95,118.83 143.38,120.4 135,120.4 133.9,119.3 v133.9,118.6 | v123.1,118.9 123.1,117.8 123.1,114.45 v123.35,114.2 | v124.9,117.1 126.4,118.6 v133.9,118.6 | v133.9,118.6 v133.9,114.6
  Bottom 0.203: IC36.19 v133.9,118.6 133.9,117.9 133.1,117.1 IC36.22 | IC36.27 v133.9,114.6 | IC36.6 v124.9,117.1 v123.1,118.9 C22.1 | IC36.1 123.75,114.6 v123.35,114.2 123.35,112.95 122.8,112.4 121.3,112.4 120.95,112.05 R3.1 R2.1 | R4.2 v119.45,117.75
  Bottom 0.406: C2.+ v144.95,118.83 IC37.2 IC37.4

### Text on the board
bPlace: github.com/netcatu | redox-light | v1.0.0